# EAGLE design BeaconKeyer_RevA (EAGLE 7.6.0)
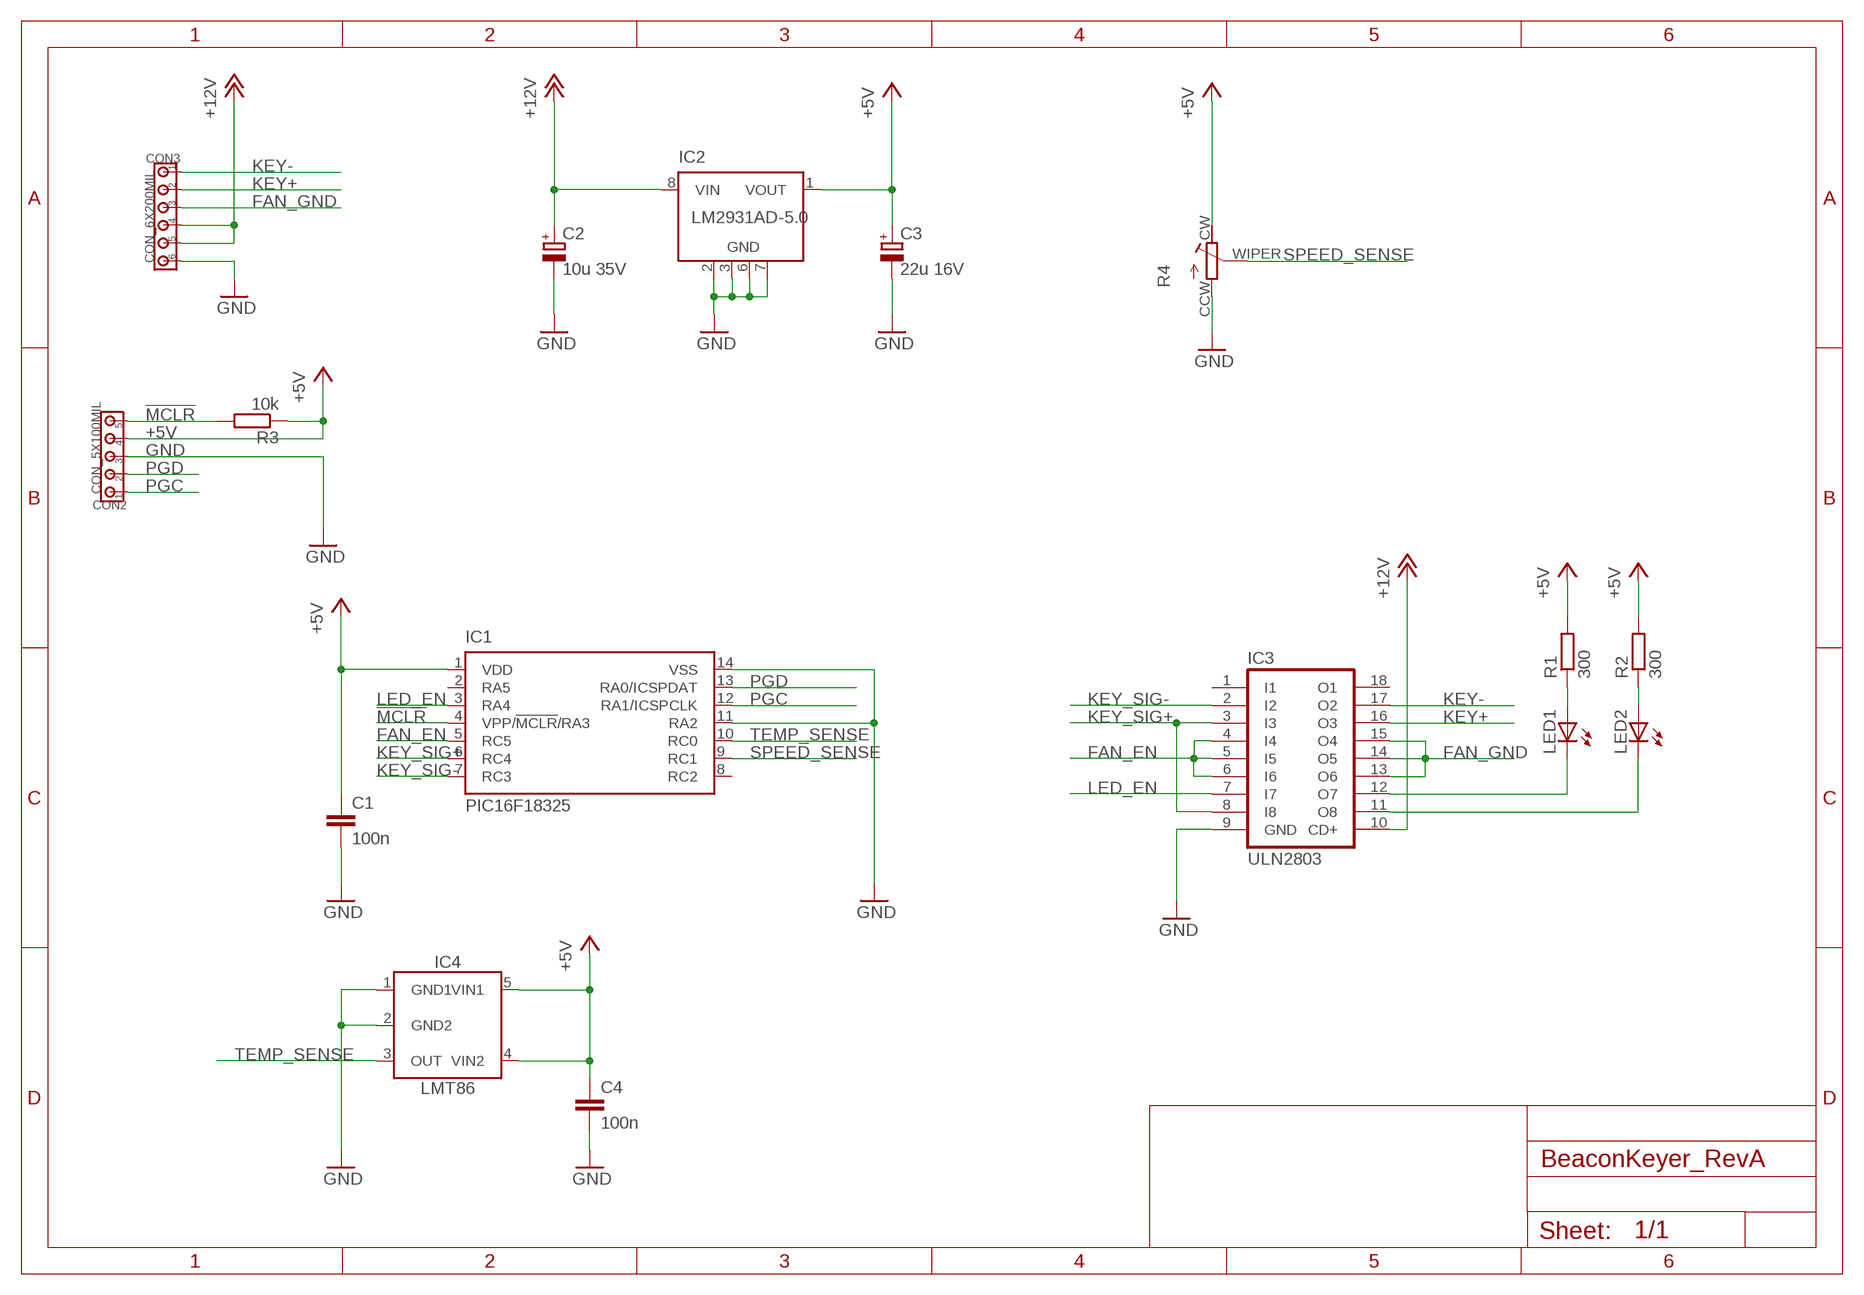
[diagram p0: schematic, sheet 1]

## Parts
C1  100n  CC0805  [C0805]
C2  10u 35V  C_POLARIZEDSMC_C  [SMC_C]
C3  22u 16V  C_POLARIZEDSMC_C  [SMC_C]
C4  100n  CC0805  [C0805]
CON2  CON_5X100MIL  [100MIL_5X]
CON3  CON_6X200MIL  [200MIL_6X]
IC1  PIC16F18325  [SO14]
IC2  LM2931AD-5.0  [SOIC8]
IC3  ULN2803  [SO18W]
IC4  LMT86  [SC70-5]
LED1  LED0805  [LED0805]
LED2  LED0805  [LED0805]
R1  300  RESISTORR0805  [R0805]
R2  300  RESISTORR0805  [R0805]
R3  10k  RESISTORR0805  [R0805]
R4  TRIMMER3314G  [RTRIM3314G]

## Nets
!MCLR!: CON2.5 IC1.4(VPP/!MCLR!/RA3) R3.2
+5V: C1.1 C3.+ C4.1 CON2.4 IC1.1(VDD) IC2.1(VOUT) IC4.4(VIN2) IC4.5(VIN1) R1.2 R2.2 R3.1 R4.CW
+12V: C2.+ CON3.4 CON3.5 IC2.8(VIN) IC3.10(CD+)
FAN_EN: IC1.5(RC5) IC3.4(I4) IC3.5(I5) IC3.6(I6)
FAN_GND: CON3.3 IC3.13(O6) IC3.14(O5) IC3.15(O4)
GND: C1.2 C2.- C3.- C4.2 CON2.3 CON3.6 IC1.11(RA2) IC1.14(VSS) IC2.2(GND) IC2.3(GND) IC2.6(GND) IC2.7(GND) IC3.9(GND) IC4.1(GND1) IC4.2(GND2) R4.CCW
KEY+: CON3.2 IC3.16(O3)
KEY-: CON3.1 IC3.17(O2)
KEY_SIG+: IC1.6(RC4) IC3.3(I3) IC3.8(I8)
KEY_SIG-: IC1.7(RC3) IC3.2(I2)
LED_EN: IC1.3(RA4) IC3.7(I7)
N$1: LED2.A R2.1
N$2: LED1.A R1.1
N$3: IC3.11(O8) LED2.C
N$4: IC3.12(O7) LED1.C
PGC: CON2.1 IC1.12(RA1/ICSPCLK)
PGD: CON2.2 IC1.13(RA0/ICSPDAT)
SPEED_SENSE: IC1.9(RC1) R4.WIPER
TEMP_SENSE: IC1.10(RC0) IC4.3(OUT)
Unconnected: IC1.2(RA5) IC1.8(RC2) IC3.1(I1) IC3.18(O1)

## Library data of the parts
C1 C4 = 00Capacitor:C: Capacitor
C2 C3 = 00Capacitor:C_POLARIZED
CON2 = 00Connector:CON_5X: 5-pin header
CON3 = 00Connector:CON_6X: 6-pin header
IC1 = 00PIC:PIC16F18325
IC2 = 00VoltageRegulator:LM2931*
IC3 = 00Transistor:ULN2803
IC4 = 00Sensor:LMT86: Analog Temperature Sensors with Class-AB Output
LED1 LED2 = 00Display:LED: LED
R1-R3 = 00Resistor:RESISTOR: RESISTOR, European symbol
R4 = 00Resistor:TRIMMER

## Board
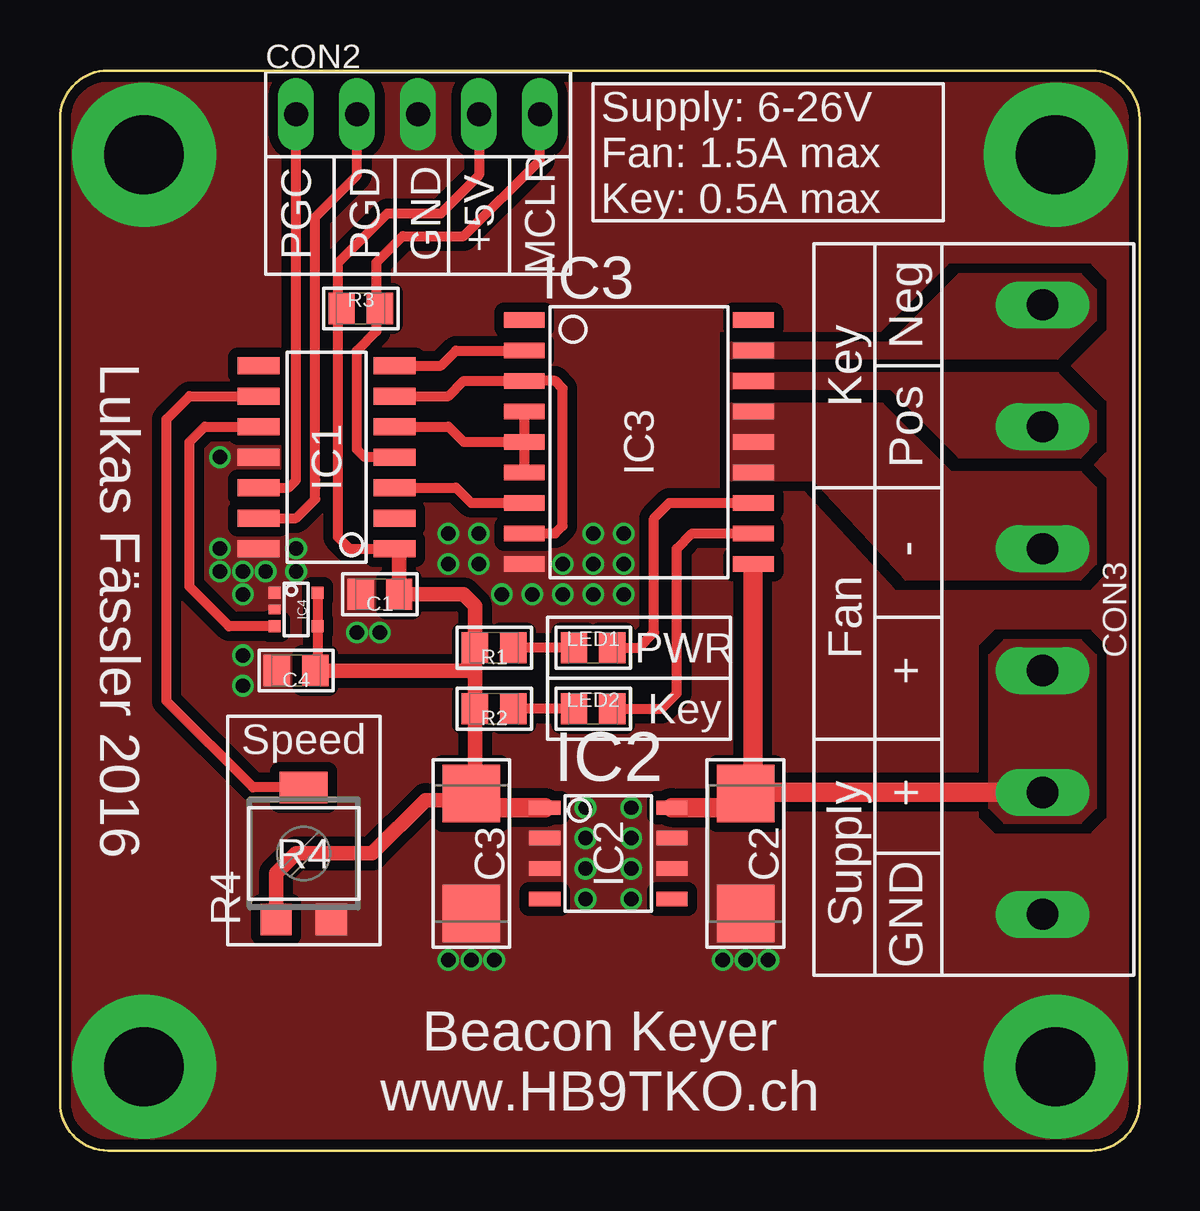
[diagram p1: board, top side]
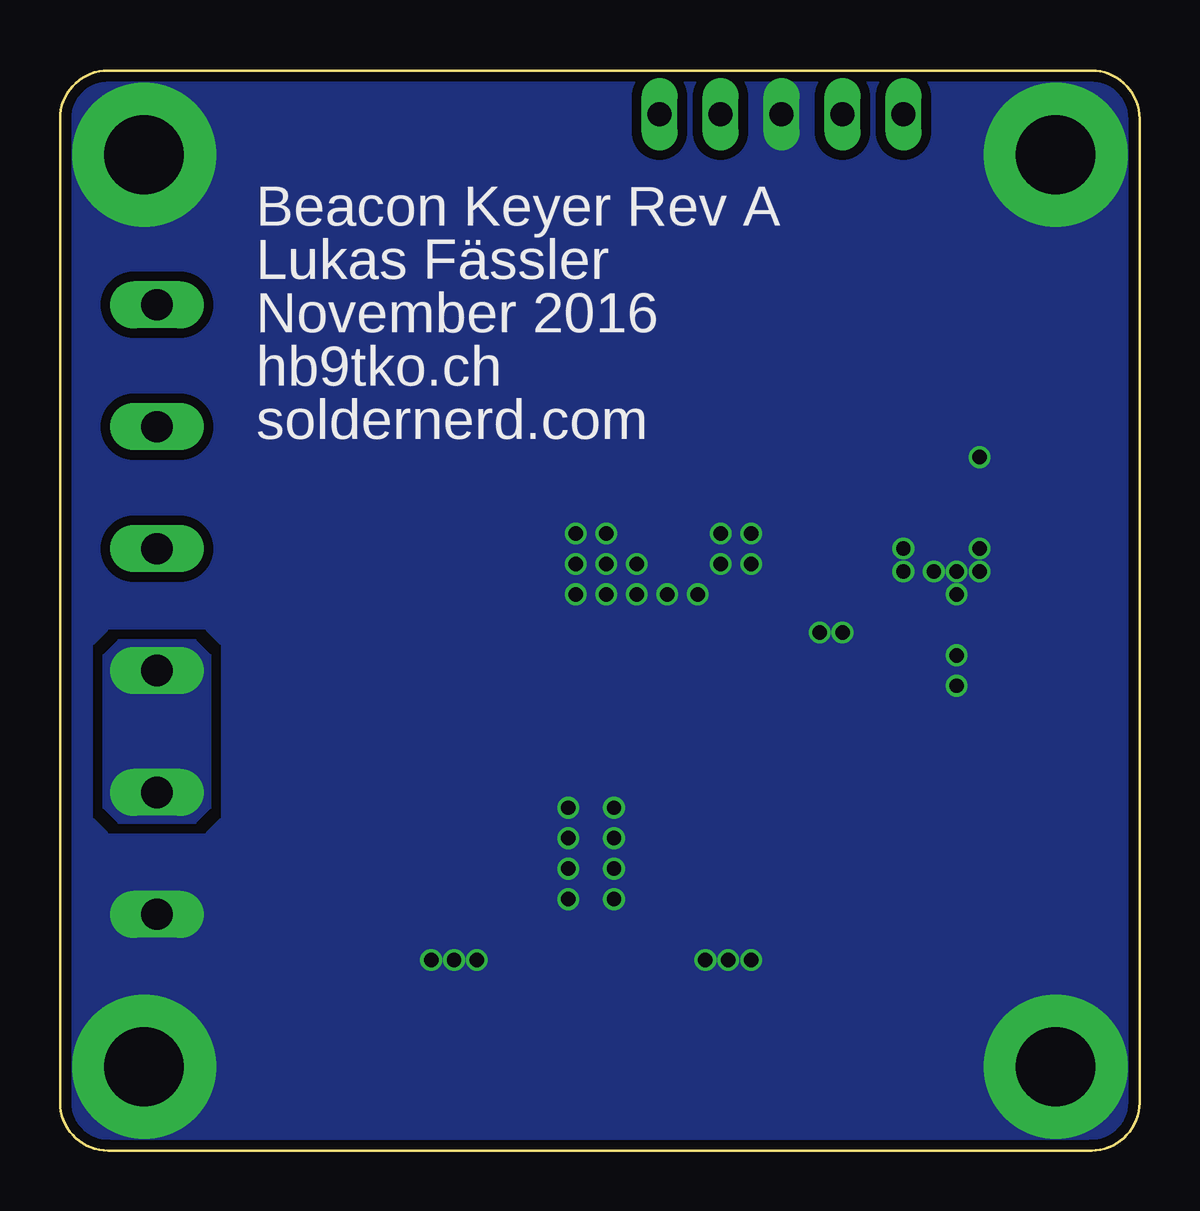
[diagram p2: board, bottom side, seen from below]

Size 45 x 45 mm. Coordinates in mm from the lower left corner, seen from the top.
Outline: 0,43 arc-90 2,45 43,45 arc-90 45,43 45,2 arc-90 43,0 2,0 arc-90 0,2 0,43
Copper layers (1*16): Top 0.035mm / dielectric 1.5mm / Bottom 0.035mm
Design rules "dirt_cheap_dirty_boards.v1": minimum track width 5mil, minimum drill 12mil, track to track 5mil, track to pad 5mil, pad to pad 5mil, via to via 5mil, smd to smd 0mil, copper to edge 10mil, drill to drill 10mil, minimum pad ring 10mil, minimum via ring 6mil, stop-mask expansion 2mil, vias tented up to drill 25mil, thermal gap 10mil

### Footprints (pad centres in the part's own frame; a part is rotated, then mirrored left to right if it is on the bottom)
C0805 = smd 1.1 x 1.3: 1 -0.8,0; 2 0.8,0
SMC_C = smd 2.4 x 2.4: + -2.5,0; - 2.5,0
100MIL_5X = drill 1 long: 1 -5.08,0; 2 -2.54,0; 3 0,0; 4 2.54,0; 5 5.08,0
200MIL_6X = drill 1.3 long: 1 -12.7,0; 2 -7.62,0; 3 -2.54,0; 4 2.54,0; 5 7.62,0; 6 12.7,0
SO14 = smd 0.7 x 1.75: 1 -3.81,-2.825; 2 -2.54,-2.825; 3 -1.27,-2.825; 4 0,-2.825; 5 1.27,-2.825; 6 2.54,-2.825; 7 3.81,-2.825; 8 3.81,2.825; 9 2.54,2.825; 10 1.27,2.825; 11 0,2.825; 12 -1.27,2.825; 13 -2.54,2.825; 14 -3.81,2.825
SOIC8 = smd 1.3 x 0.6: 1 -2.65,1.905; 2 -2.65,0.635; 3 -2.65,-0.635; 4 -2.65,-1.905; 5 2.65,-1.905; 6 2.65,-0.635; 7 2.65,0.635; 8 2.65,1.905
SO18W = smd 0.65 x 1.7: 1 -5.08,-4.78; 2 -3.81,-4.78; 3 -2.54,-4.78; 4 -1.27,-4.78; 5 0,-4.78; 6 1.27,-4.78; 7 2.54,-4.78; 8 3.81,-4.78; 9 5.08,-4.78; 10 5.08,4.78; 11 3.81,4.78; 12 2.54,4.78; 13 1.27,4.78; 14 0,4.78; 15 -1.27,4.78; 16 -2.54,4.78; 17 -3.81,4.78; 18 -5.08,4.78
SC70-5 = smd 0.5 x 0.5: 1 -0.7,-0.9; 3 0.7,-0.9; 4 0.7,0.9; 5 -0.7,0.9 | smd 0.4 x 0.5: 2 0,-0.9
LED0805 = smd 1.1 x 1.3: A -0.8,0; C 0.8,0
R0805 = smd 1.1 x 1.3: 1 -0.8,0; 2 0.8,0
RTRIM3314G = smd 1.3 x 1.3: CCW 1.15,-2.75; CW -1.15,-2.75 | smd 2 x 1.3: WIPER 0,2.75

### Placement (x,y rotation side)
C1  13.34,23.18 180 top
C2  28.57,12.38 270 top
C3  17.14,12.38 270 top
C4  9.84,20 180 top
CON2  14.92,43.18 0 top
CON3  40.96,22.54 270 top
IC1  11.11,28.89 90 top
IC2  22.86,12.38 0 top
IC3  24.13,29.53 270 top
IC4  9.84,22.54 270 top
LED1  22.23,20.95 0 top
LED2  22.23,18.41 0 top
R1  18.1,20.95 180 top
R2  18.1,18.41 180 top
R3  12.54,35.08 0 top
R4  10.16,12.38 0 top

### Tracks (layer width: path | path; a pad name or v marks a point on that pad's centre or on a via)
!MCLR!
  Top 0.406: IC1.4 12.7,28.89 12.38,29.21 12.38,33.34 13.18,34.14 13.18,35.24 | CON2.5 20,41.27 16.83,38.1 14.29,38.1 13.18,36.99 13.18,35.24 | 13.18,35.24 R3.2
+5V
  Top 0.406: 17.3,15.04 C3.+ 16.87,14.61 | 16.98,21.27 R1.2 | CON2.4 17.46,40.64 15.88,39.05 13.65,39.05 11.58,36.98 11.58,34.61 | IC4.5 IC4.4 10.74,20.1 C4.1 | 11.58,34.61 11.59,34.61 11.59,25.56 12.06,25.08 IC1.1 13.99,25.03 14.13,25.03 | 11.58,34.61 11.74,34.77 R3.1
  Top 0.61: 17.3,20 R1.2 17.3,22.71 16.83,23.18 C1.1 14.13,25.03 | 17.3,20 R2.2 17.3,15.04 | R4.CW 9.01,11.55 9.84,12.38 13.02,12.38 15.24,14.61 16.87,14.61 | C4.1 17.3,20
  Top 0.813: IC2.1 17.74,14.29 C3.+
+12V
  Top 0.406: 28.89,24.13 28.89,24.18 IC3.10
  Top 0.813: 28.61,14.92 C2.+ | IC2.8 27.98,14.29 C2.+ | C2.+ 28.91,15.22 28.89,15.22 28.89,24.13 | CON3.5 28.57,14.92 C2.+
  pour Top (isolate 0.406, no thermals): 39.37,21.27 42.55,21.27 43.18,20.64 43.18,14.29 42.55,13.65 39.37,13.65 38.73,14.29 38.73,20.64
  pour Bottom (isolate 0.406, no thermals): 38.73,20.64 39.37,21.27 42.55,21.27 43.18,20.64 43.18,14.29 42.55,13.65 39.37,13.65 38.73,14.29
FAN_EN
  Top 0.406: IC1.5 16.19,30.16 16.83,29.53 IC3.5 | IC3.4 IC3.5 | IC3.5 IC3.6
FAN_GND
  pour Top (isolate 0.406, rank 2, no thermals): 34.29,31.11 27.94,31.11 27.94,27.94 31.43,27.94 35.24,23.81 42.55,23.81 43.18,24.45 43.18,27.62 42.55,28.26 37.15,28.26
GND  (via drill 0.6, 3.3 pad 6)
  Top 0.813: 28.61,9.84 C2.-
  other vias: 3.5,41.5 41.5,41.5 41.5,3.5 3.5,3.5 16.19,25.72 17.46,25.72 16.19,24.45 17.46,24.45 18.41,23.18 19.68,23.18 20.95,23.18 22.23,23.18 23.5,23.18 23.5,24.45 22.23,24.45 20.95,24.45 13.34,21.59 12.38,21.59 9.84,25.08 7.62,24.13 7.62,23.18 7.62,20.64 7.62,19.37 16.19,7.94 17.14,7.94 18.1,7.94 27.62,7.94 28.57,7.94 29.53,7.94 21.91,14.29 23.81,14.29 21.91,13.02 23.81,13.02 21.91,11.75 23.81,11.75 21.91,10.48 23.81,10.48 6.67,28.89 8.57,24.13 9.84,24.13 6.67,24.13 22.23,25.72 23.5,25.72 6.67,25.08
  pour Bottom (isolate 0.406, rank 2, no thermals): 0,30 0,43 arc-90 2,45 20,45 43,45 arc-90 45,43 45,25 45,2 arc-90 43,0 25,0 2,0 arc-90 0,2
  pour Top (isolate 0.406, rank 4, no thermals): 0,20 0,43 arc-90 2,45 25,45 43,45 arc-90 45,43 45,15 45,2 arc-90 43,0 25,0 2,0 arc-90 0,2
KEY+
  pour Top (isolate 0.406, no thermals): 27.94,32.38 41.59,32.38 43.18,30.8 43.18,29.53 42.55,28.89 37.47,28.89 34.61,31.75 27.94,31.75
KEY-
  pour Top (isolate 0.406, no thermals): 27.94,33.02 41.59,33.02 43.18,34.61 43.18,35.88 42.55,36.51 37.47,36.51 34.61,33.66 27.94,33.66
KEY_SIG+
  Top 0.406: IC1.6 16.19,31.43 16.83,32.07 IC3.3 20.64,32.07 20.95,31.75 20.95,26.04 20.64,25.72 IC3.8
KEY_SIG-
  Top 0.406: IC1.7 15.88,32.7 16.51,33.34 IC3.2
LED_EN
  Top 0.406: IC1.3 16.51,27.62 17.14,26.99 IC3.7
N$1
  Top 0.406: LED2.A R2.1
N$2
  Top 0.406: LED1.A R1.1
N$3
  Top 0.406: LED2.C 25.08,18.41 25.72,19.05 25.72,25.08 26.35,25.72 IC3.11
N$4
  Top 0.406: LED1.C 24.13,20.95 24.77,21.59 24.77,26.35 25.4,26.99 IC3.12
PGC
  Top 0.406: IC1.12 9.53,27.62 9.84,27.94 CON2.1
PGD
  Top 0.406: IC1.13 9.84,26.35 10.64,27.15 10.64,27.62 10.64,27.94 10.64,38.89 12.38,40.64 CON2.2
SPEED_SENSE
  Top 0.406: IC1.9 5.4,31.43 4.45,30.48 4.45,18.73 8.04,15.13 R4.WIPER
TEMP_SENSE
  Top 0.406: IC1.10 6.03,30.16 5.4,29.53 5.4,23.5 7.05,21.84 IC4.3

### Text on the board
tPlace: Supply: 6-26V | Fan: 1.5A max | Key: 0.5A max | PGC | PGD | GND | +5V | MCLR | Neg | Key | Pos | - | Lukas Fässler 2016 | Fan | PWR | + | Key | Speed | + | Supply | GND | Beacon Keyer | www.HB9TKO.ch
bPlace: Beacon Keyer Rev A | Lukas Fässler | November 2016 | hb9tko.ch | soldernerd.com